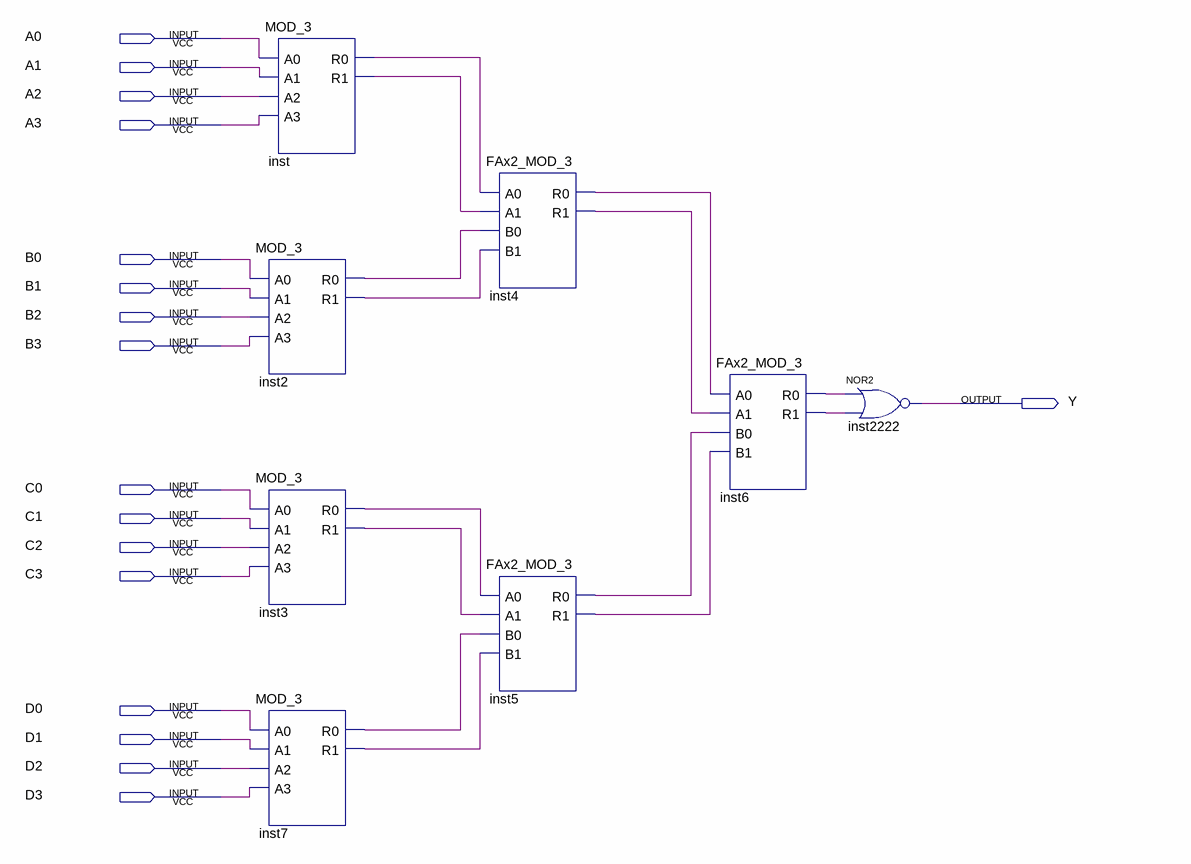
[diagram p0: schematic sheet]
// Quartus schematic main.bdf as structural Verilog: 8 symbols, 17 pins
module main (
  input  A0,
  input  A1,
  input  A2,
  input  A3,
  input  B0,
  input  B1,
  input  B2,
  input  B3,
  input  C0,
  input  C1,
  input  C2,
  input  C3,
  input  D0,
  input  D1,
  input  D2,
  input  D3,
  output Y
);

  wire inst2_r0, inst2_r1, inst3_r0, inst3_r1, inst4_r0, inst4_r1, inst5_r0, inst5_r1, inst6_r0, inst6_r1,
       inst7_r0, inst7_r1, inst_r0, inst_r1;

  MOD_3 inst (.A0(A0), .A1(A1), .A2(A2), .A3(A3), .R0(inst_r0), .R1(inst_r1));
  MOD_3 inst2 (.A0(B0), .A1(B1), .A2(B2), .A3(B3), .R0(inst2_r0), .R1(inst2_r1));
  MOD_3 inst3 (.A0(C0), .A1(C1), .A2(C2), .A3(C3), .R0(inst3_r0), .R1(inst3_r1));
  MOD_3 inst7 (.A0(D0), .A1(D1), .A2(D2), .A3(D3), .R0(inst7_r0), .R1(inst7_r1));
  FAx2_MOD_3 inst4 (.A0(inst_r0), .A1(inst_r1), .B0(inst2_r0), .B1(inst2_r1), .R0(inst4_r0), .R1(inst4_r1));
  FAx2_MOD_3 inst5 (.A0(inst3_r0), .A1(inst3_r1), .B0(inst7_r0), .B1(inst7_r1), .R0(inst5_r0), .R1(inst5_r1));
  FAx2_MOD_3 inst6 (.A0(inst4_r0), .A1(inst4_r1), .B0(inst5_r0), .B1(inst5_r1), .R0(inst6_r0), .R1(inst6_r1));
  nor inst2222 (Y, inst6_r0, inst6_r1);
endmodule
